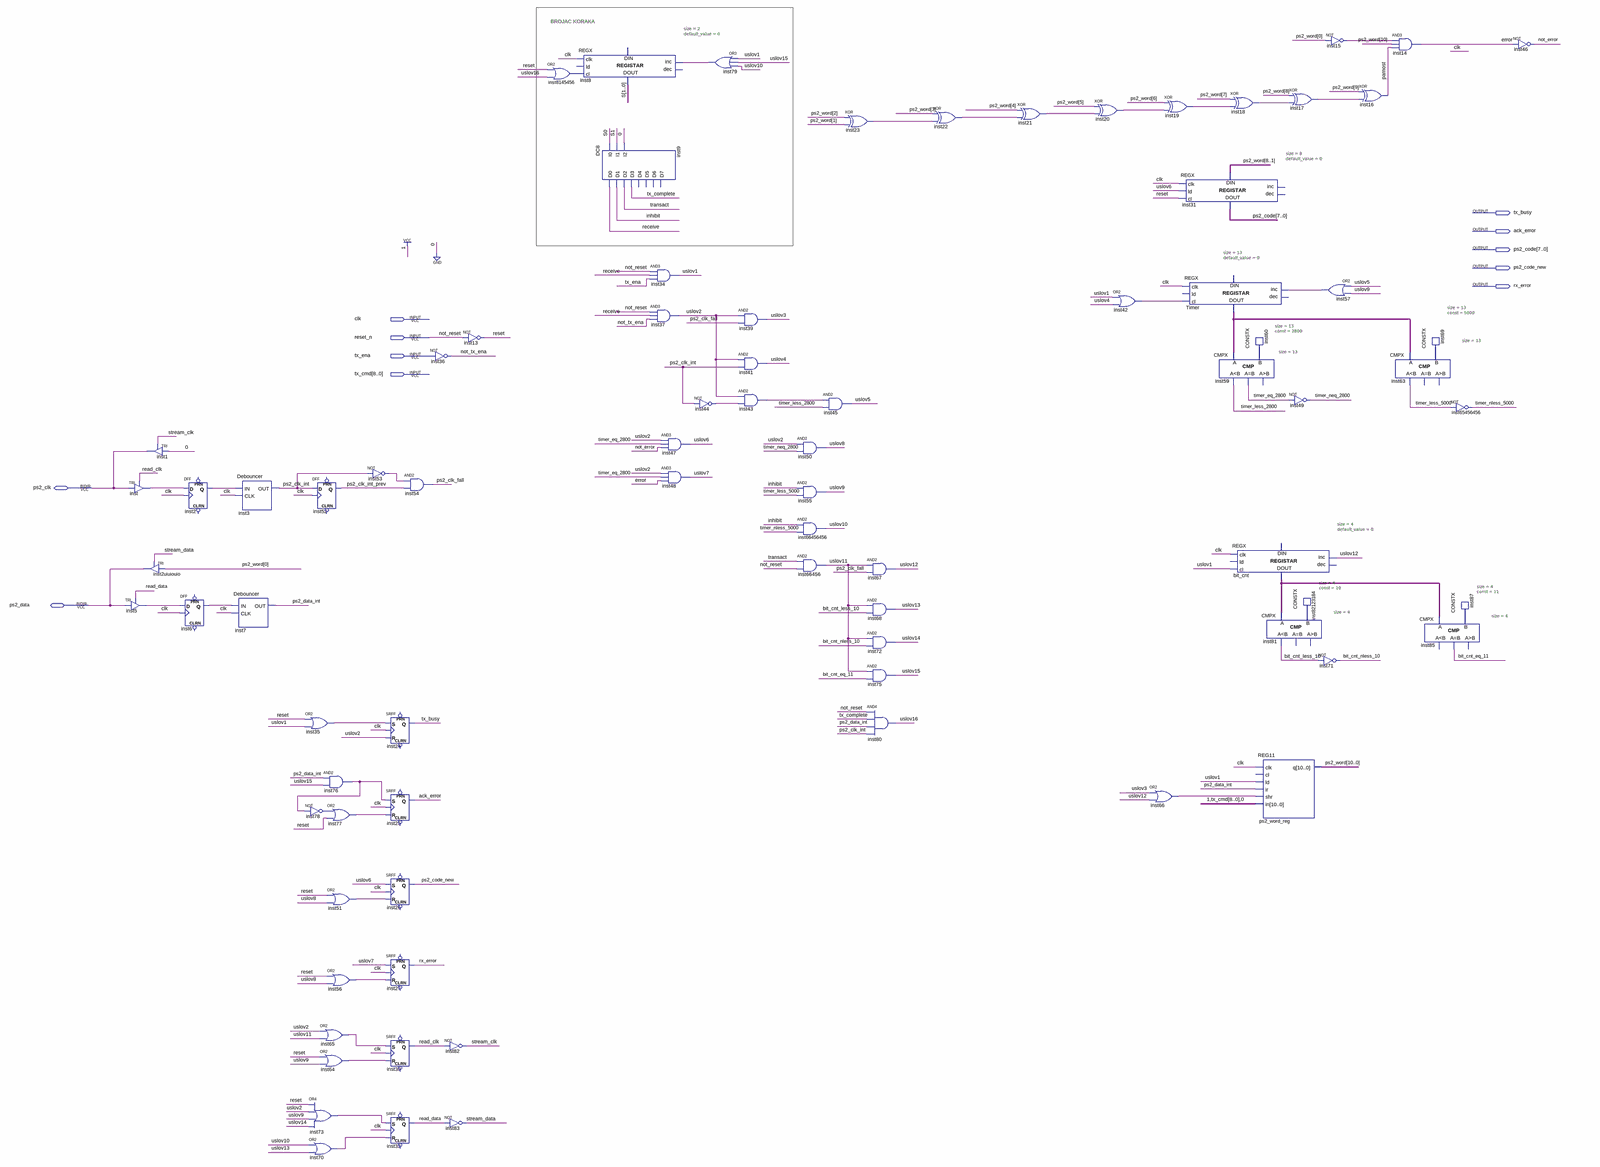
[diagram p0: schematic sheet, whole]
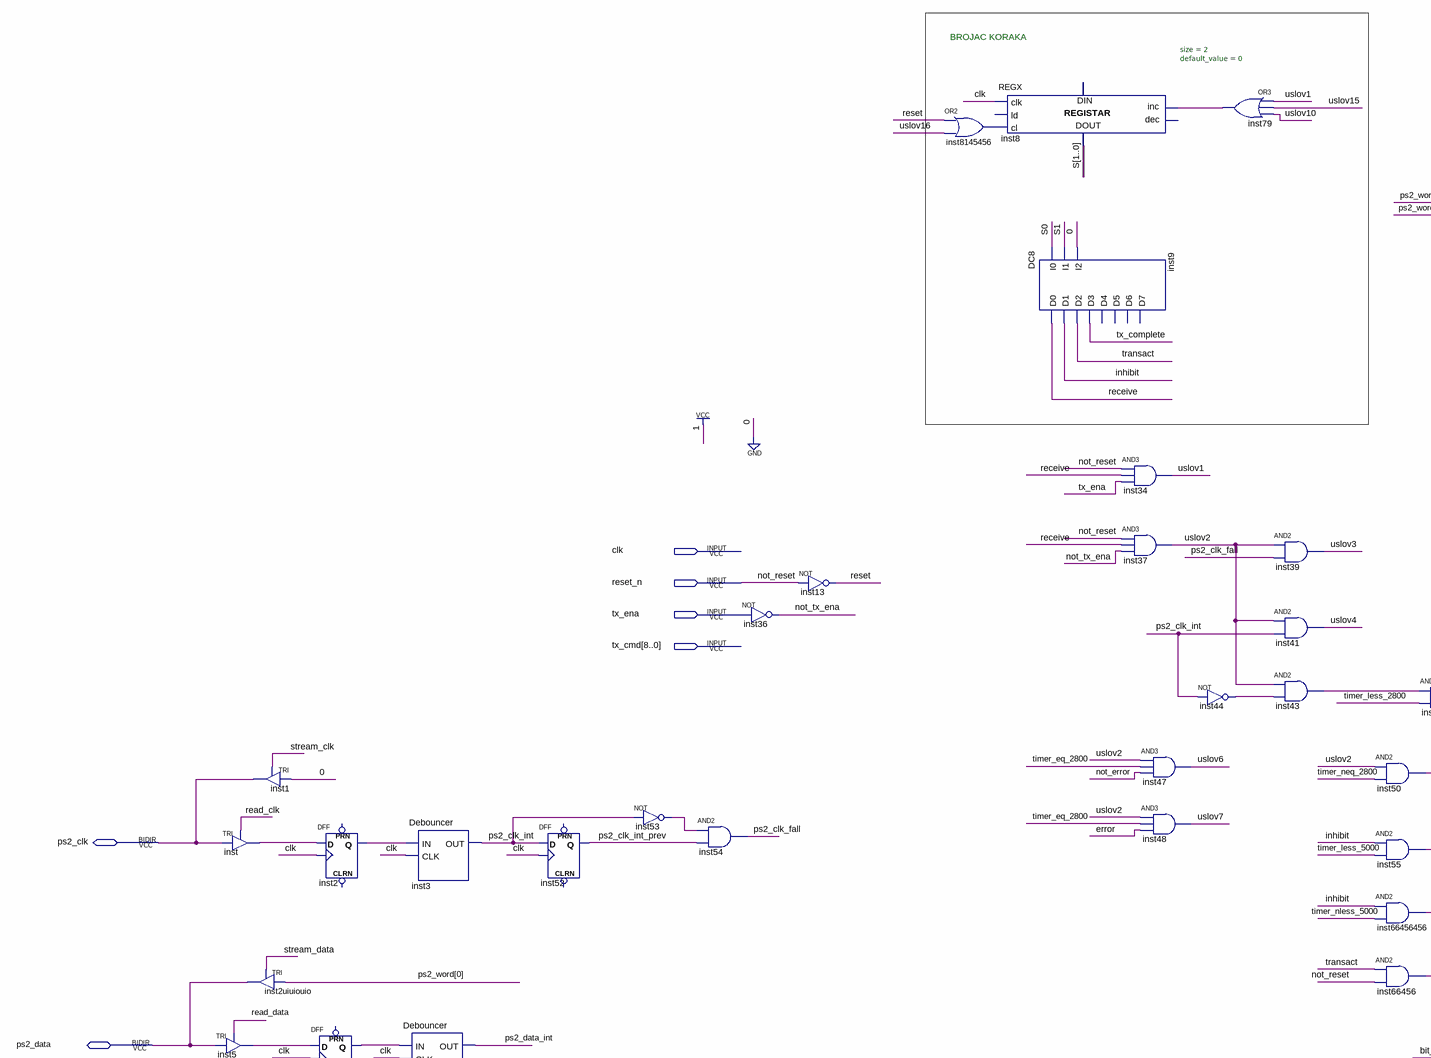
[diagram p1: schematic sheet, upper left part]
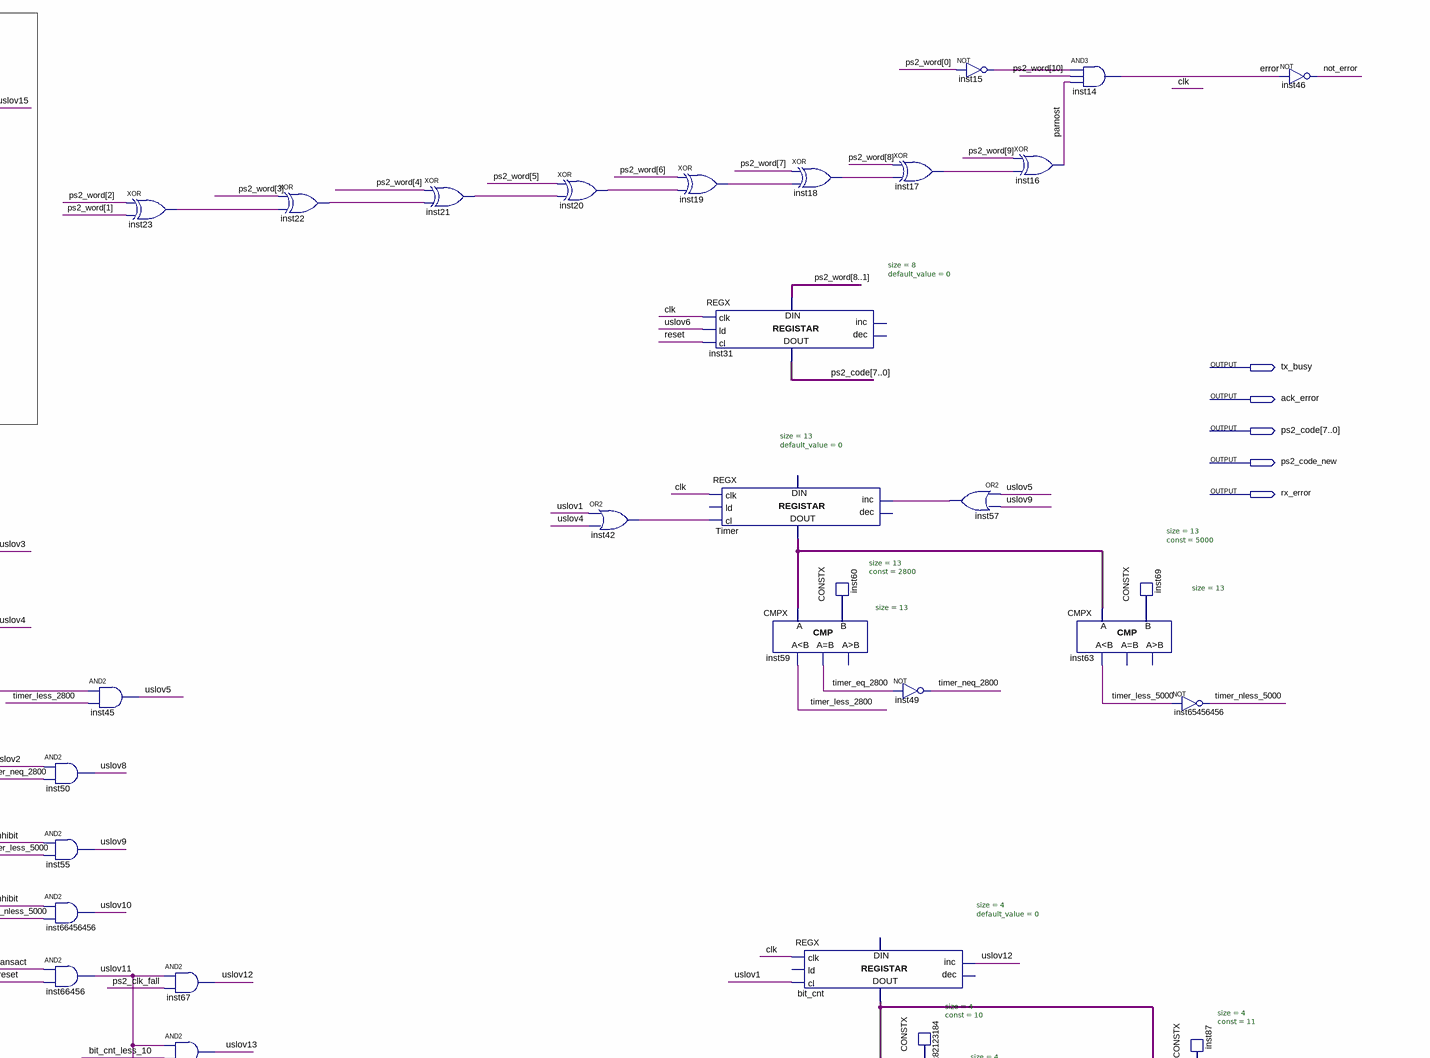
[diagram p2: schematic sheet, upper right part]
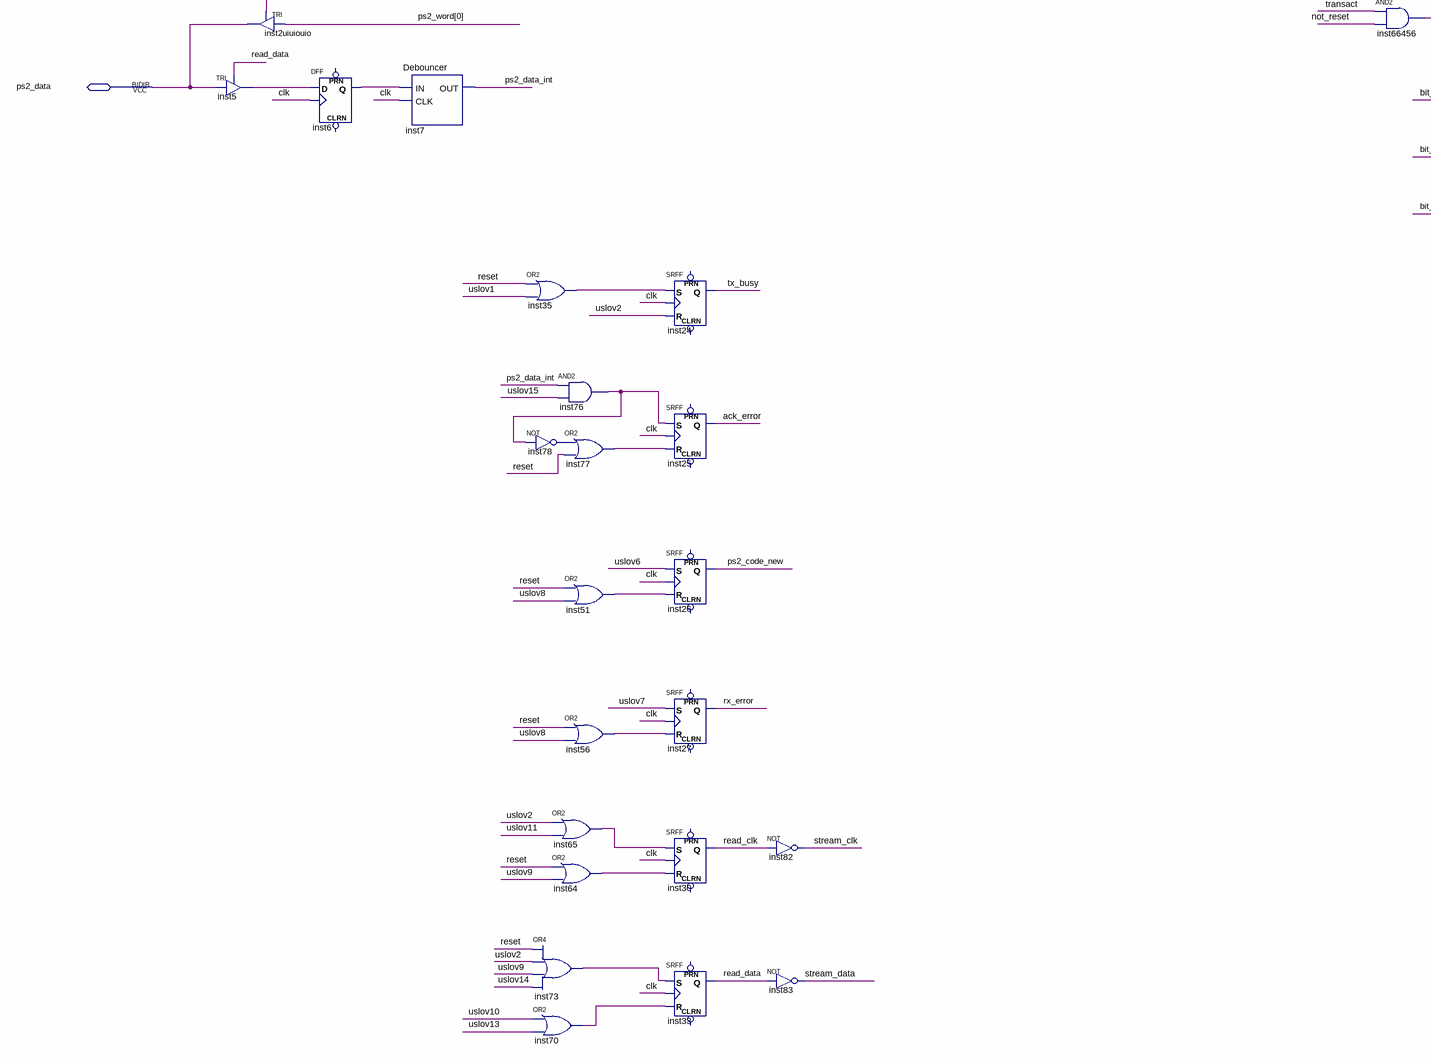
[diagram p3: schematic sheet, lower left part]
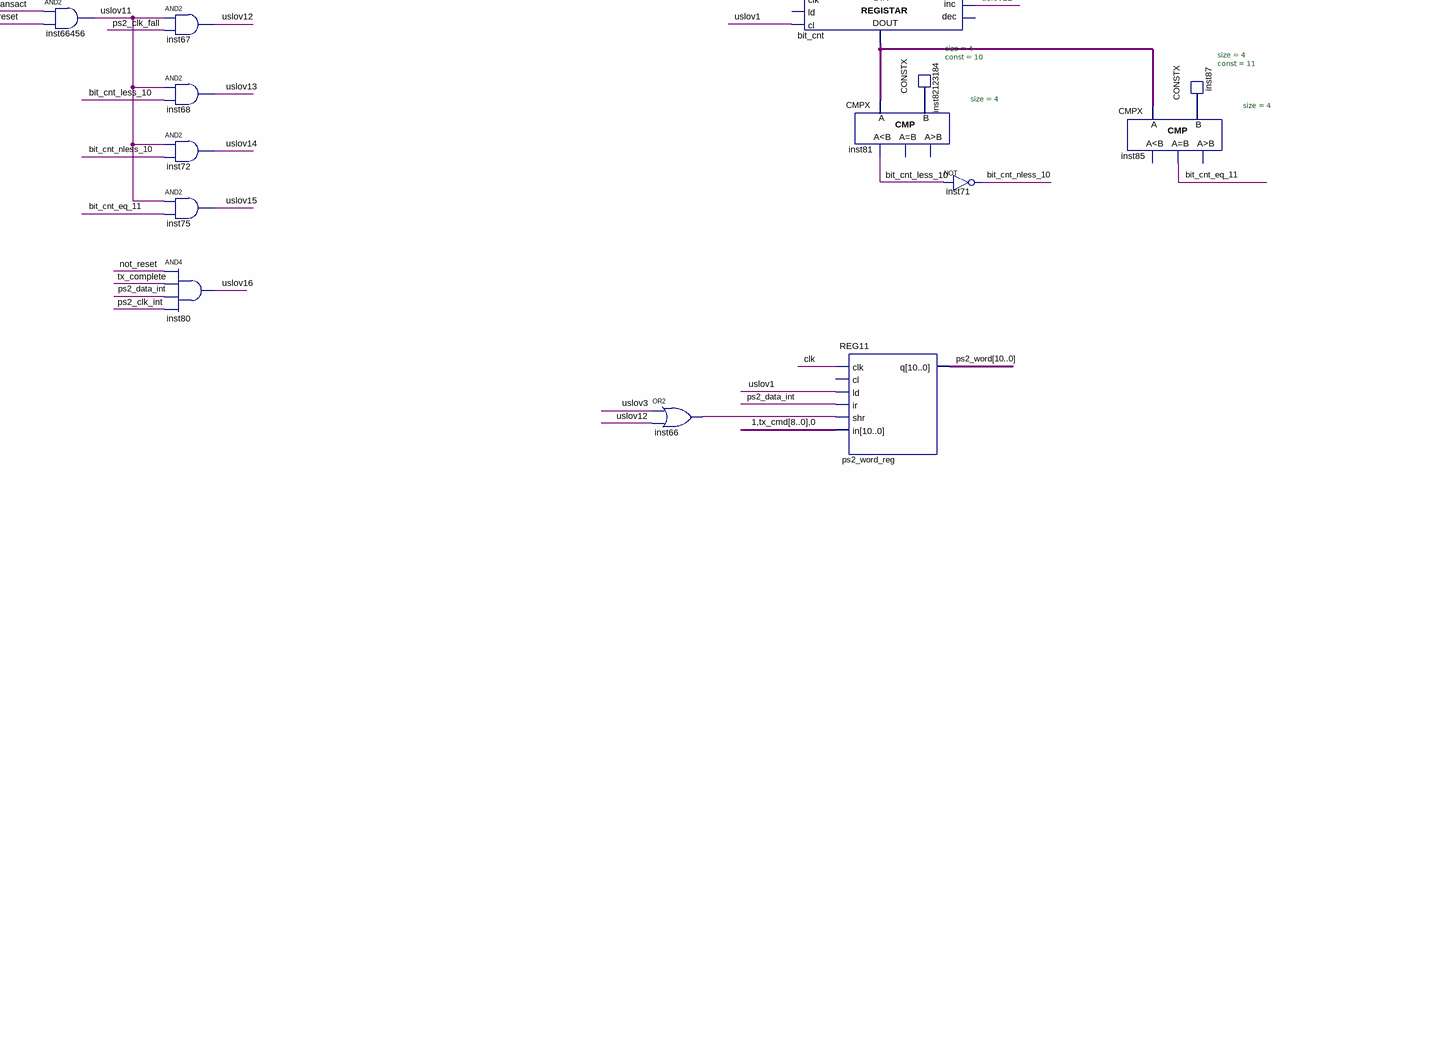
[diagram p4: schematic sheet, lower right part]
// Quartus schematic Transceiver2.bdf as structural Verilog: 82 symbols, 11 pins
module Transceiver2 (
  input  clk,
  input  reset_n,
  input  tx_ena,
  input  [8:0] tx_cmd,
  inout  ps2_clk,
  inout  ps2_data,
  output tx_busy,
  output ack_error,
  output [7:0] ps2_code,
  output ps2_code_new,
  output rx_error
);

  wire bit_cnt_eq_11, bit_cnt_less_10, bit_cnt_nless_10, error, inhibit, inst2_q, inst5_out, inst6_q,
       inst15_out, inst17_out, inst18_out, inst19_out, inst20_out, inst21_out, inst22_out, inst23_out,
       inst35_out, inst42_out, inst43_out, inst44_out, inst51_out, inst53_out, inst56_out, inst57_out,
       inst64_out, inst65_out, inst66_out, inst70_out, inst73_out, inst76_out, inst77_out, inst78_out,
       inst79_out, inst8145456_out, inst_out, not_error, not_tx_ena, parnost, ps2_clk_fall, ps2_clk_int,
       ps2_clk_int_prev, ps2_data_int, read_clk, read_data, receive, reset, stream_clk, stream_data,
       timer_eq_2800, timer_less_2800, timer_less_5000, timer_neq_2800, timer_nless_5000, transact,
       tx_complete, uslov1, uslov2, uslov3, uslov4, uslov5, uslov6, uslov7, uslov8, uslov9, uslov10, uslov11,
       uslov12, uslov13, uslov14, uslov15, uslov16;
  wire [1:0] S;
  wire [3:0] bit_cnt_data_out, inst87_data, inst82123184_data;
  wire [10:0] ps2_word;
  wire [12:0] inst60_data, inst69_data, Timer_data_out;

  TRI inst (.IN(ps2_clk), .OE(read_clk), .OUT(inst_out));
  TRI inst5 (.IN(ps2_data), .OE(read_data), .OUT(inst5_out));
  TRI inst1 (.IN(1'b0), .OE(stream_clk), .OUT(ps2_clk));
  TRI inst2uiuiouio (.IN(ps2_word[0]), .OE(stream_data), .OUT(ps2_data));
  DFF inst2 (.CLK(clk), .D(inst_out), .Q(inst2_q));  // open: CLRN, PRN
  DFF inst6 (.CLK(clk), .D(inst5_out), .Q(inst6_q));  // open: CLRN, PRN
  Debouncer inst3 (.IN(inst2_q), .CLK(clk), .OUT(ps2_clk_int));
  Debouncer inst7 (.IN(inst6_q), .CLK(clk), .OUT(ps2_data_int));
  DFF inst52 (.CLK(clk), .D(ps2_clk_int), .Q(ps2_clk_int_prev));  // open: CLRN, PRN
  or inst35 (inst35_out, reset, uslov1);
  not inst78 (inst78_out, inst76_out);
  or inst73 (inst73_out, reset, uslov2, uslov9, uslov14);
  or inst70 (inst70_out, uslov10, uslov13);
  and inst76 (inst76_out, ps2_data_int, uslov15);
  or inst77 (inst77_out, inst78_out, reset);
  or inst51 (inst51_out, reset, uslov8);
  or inst56 (inst56_out, reset, uslov8);
  or inst65 (inst65_out, uslov2, uslov11);
  or inst64 (inst64_out, reset, uslov9);
  not inst53 (inst53_out, ps2_clk_int);
  SRFF inst24 (.S(inst35_out), .R(uslov2), .CLK(clk), .Q(tx_busy));  // open: PRN, CLRN
  SRFF inst25 (.S(inst76_out), .R(inst77_out), .CLK(clk), .Q(ack_error));  // open: PRN, CLRN
  SRFF inst26 (.S(uslov6), .R(inst51_out), .CLK(clk), .Q(ps2_code_new));  // open: PRN, CLRN
  SRFF inst27 (.S(uslov7), .R(inst56_out), .CLK(clk), .Q(rx_error));  // open: PRN, CLRN
  SRFF inst30 (.S(inst65_out), .R(inst64_out), .CLK(clk), .Q(read_clk));  // open: PRN, CLRN
  SRFF inst33 (.S(inst73_out), .R(inst70_out), .CLK(clk), .Q(read_data));  // open: PRN, CLRN
  not inst36 (not_tx_ena, tx_ena);
  and inst54 (ps2_clk_fall, inst53_out, ps2_clk_int_prev);
  not inst82 (stream_clk, read_clk);
  not inst83 (stream_data, read_data);
  not inst13 (reset, reset_n);
  or inst8145456 (inst8145456_out, reset, uslov16);
  REGX #(.size(2), .default_value(0)) inst8 (
    .clk(clk), .cl(inst8145456_out), .inc(inst79_out), .data_out(S));  // open: ld, dec, data_in
  DC8 inst9 (
    .I0(S[0]), .I1(S[1]), .I2(1'b0), .D0(receive), .D1(inhibit), .D2(transact), .D3(tx_complete));  // open: D4, D5, D6, D7
  and inst34 (uslov1, reset_n, receive, tx_ena);
  and inst37 (uslov2, reset_n, receive, not_tx_ena);
  and inst47 (uslov6, uslov2, timer_eq_2800, not_error);
  and inst48 (uslov7, uslov2, timer_eq_2800, error);
  not inst44 (inst44_out, ps2_clk_int);
  or inst79 (inst79_out, uslov1, uslov15, uslov10);
  and inst39 (uslov3, uslov2, ps2_clk_fall);
  and inst41 (uslov4, uslov2, ps2_clk_int);
  and inst43 (inst43_out, uslov2, inst44_out);
  and inst50 (uslov8, uslov2, timer_neq_2800);
  and inst55 (uslov9, inhibit, timer_less_5000);
  and inst66456456 (uslov10, inhibit, timer_nless_5000);
  and inst66456 (uslov11, transact, reset_n);
  and inst45 (uslov5, inst43_out, timer_less_2800);
  xor inst23 (inst23_out, ps2_word[2], ps2_word[1]);
  and inst67 (uslov12, uslov11, ps2_clk_fall);
  and inst68 (uslov13, uslov11, bit_cnt_less_10);
  and inst72 (uslov14, uslov11, bit_cnt_nless_10);
  and inst75 (uslov15, uslov11, bit_cnt_eq_11);
  and inst80 (uslov16, reset_n, tx_complete, ps2_data_int, ps2_clk_int);
  xor inst22 (inst22_out, ps2_word[3], inst23_out);
  xor inst21 (inst21_out, ps2_word[4], inst22_out);
  xor inst20 (inst20_out, ps2_word[5], inst21_out);
  or inst42 (inst42_out, uslov1, uslov4);
  xor inst19 (inst19_out, ps2_word[6], inst20_out);
  or inst66 (inst66_out, uslov3, uslov12);
  REGX #(.size(8), .default_value(0)) inst31 (
    .clk(clk), .ld(uslov6), .cl(reset), .data_in(ps2_word[8:1]), .data_out(ps2_code));  // open: inc, dec
  REGX #(.size(13), .default_value(0)) Timer (
    .clk(clk), .cl(inst42_out), .inc(inst57_out), .data_out(Timer_data_out));  // open: ld, dec, data_in
  CMPX #(.size(13)) inst59 (.A(Timer_data_out), .B(inst60_data), .ls(timer_less_2800), .eq(timer_eq_2800));  // open: gr
  xor inst18 (inst18_out, ps2_word[7], inst19_out);
  CONSTX #(.size(13), .\const (2800)) inst60 (.data(inst60_data));
  REGX #(.size(4), .default_value(0)) bit_cnt (
    .clk(clk), .cl(uslov1), .inc(uslov12), .data_out(bit_cnt_data_out));  // open: ld, dec, data_in
  CMPX #(.size(4)) inst81 (.A(bit_cnt_data_out), .B(inst82123184_data), .ls(bit_cnt_less_10));  // open: eq, gr
  REG11 ps2_word_reg (
    .clk(clk), .ld(uslov1), .ir(ps2_data_int), .shr(inst66_out), .in({1'b1, tx_cmd, 1'b0}), .q(ps2_word));  // open: cl
  xor inst17 (inst17_out, ps2_word[8], inst18_out);
  not inst49 (timer_neq_2800, timer_eq_2800);
  CONSTX #(.size(4), .\const (10)) inst82123184 (.data(inst82123184_data));
  not inst15 (inst15_out, ps2_word[0]);
  or inst57 (inst57_out, uslov5, uslov9);
  not inst71 (bit_cnt_nless_10, bit_cnt_less_10);
  xor inst16 (parnost, ps2_word[9], inst17_out);
  and inst14 (error, inst15_out, ps2_word[10], parnost);
  CMPX #(.size(13)) inst63 (.A(Timer_data_out), .B(inst69_data), .ls(timer_less_5000));  // open: eq, gr
  CONSTX #(.size(13), .\const (5000)) inst69 (.data(inst69_data));
  CMPX #(.size(4)) inst85 (.A(bit_cnt_data_out), .B(inst87_data), .eq(bit_cnt_eq_11));  // open: ls, gr
  not inst65456456 (timer_nless_5000, timer_less_5000);
  CONSTX #(.size(4), .\const (11)) inst87 (.data(inst87_data));
  not inst46 (not_error, error);

  // Other names for the same wires on the sheet: not_reset = reset_n

  // Notes on the sheet:
  //   BROJAC KORAKA
endmodule
